# EAGLE design LED_Driver_Separate (EAGLE 9.6.2)
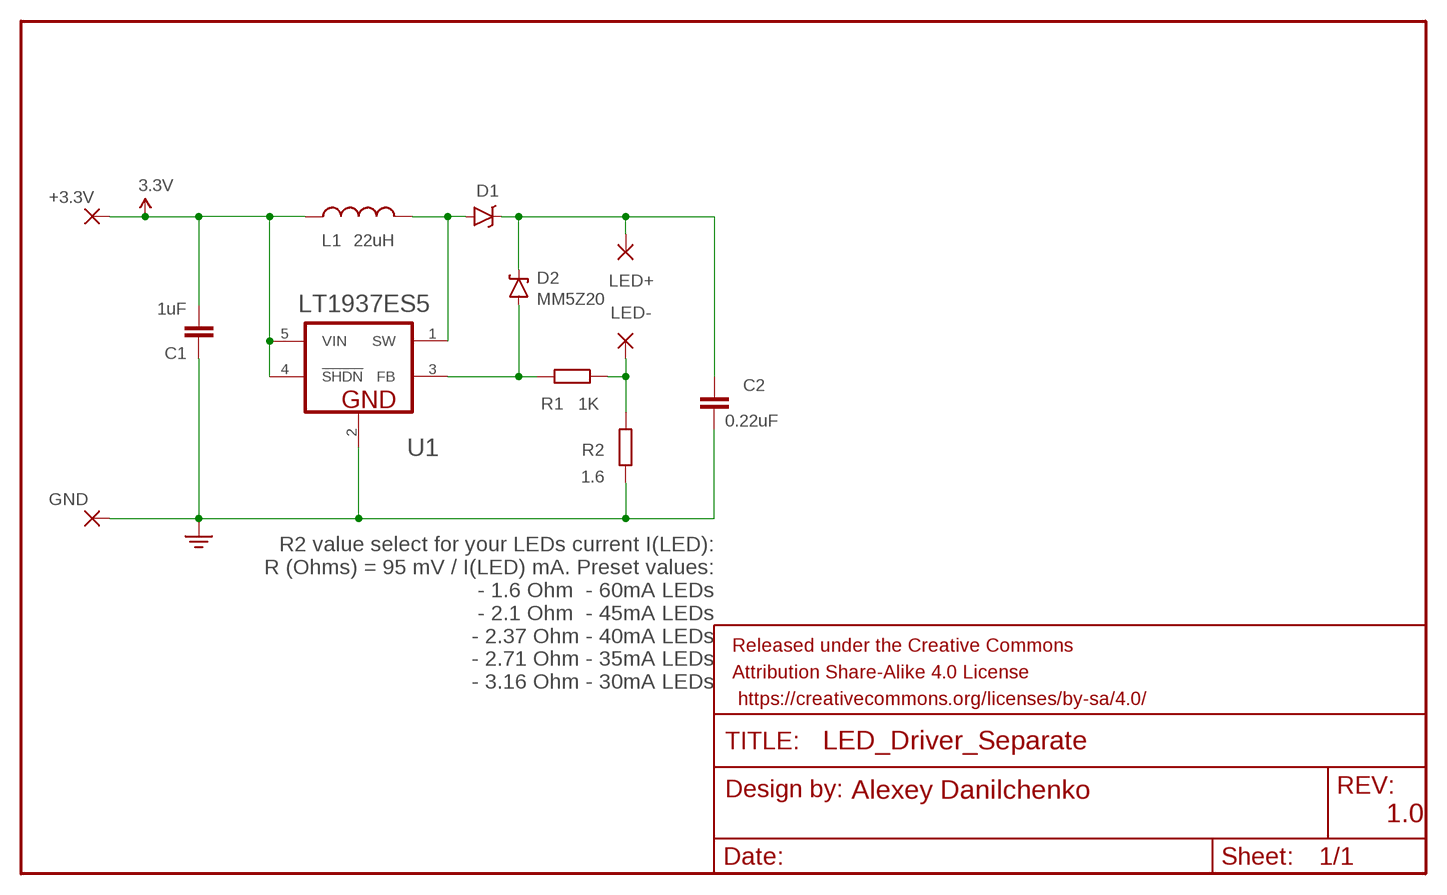
[diagram p0: schematic, sheet 1]

## Parts
+3.3V  SMD2X2  [SMD2,54-2,54]
C1  1uF  C-EUC0805  [C0805]
C2  0.22uF  CAP0603-CAP  [0603-CAP]
D1  RB751  DIODE-SCHOTTKY-RB751  [SOD-523]
D2  MM5Z20  DIODE-ZENERSOD-523Z  [SOD-523]
FRAME1  FRAME-LEDGER  [CREATIVE_COMMONS]
GND  SMD2X2  [SMD2,54-2,54]
L1  22uH  INDUCTOR1210  [1210]
LED+  SMD2X2  [SMD2,54-2,54]
LED-  SMD2X2  [SMD2,54-2,54]
R1  1K  R-EU_R0805  [R0805]
R2  1.6  R-EU_M1206  [M1206]
U1  LT1937ES5  LINEAR_TECHNOLOGY_LT1937ES5#TRMPBFLINEAR_TECHNOLOGY_LT1937ES5#TRMPBF_0_1  [LINEAR_TECHNOLOGY_LT1937ES5#TRMPBF_1]

## Nets
3.3V: +3.3V.1(P) C1.1 L1.1 U1.4(!SHDN!) U1.5(VIN)
GND: C1.2 C2.2 GND.1(P) R2.1 U1.2(GND)
N$1: D1.A L1.2 U1.1(SW)
N$2: D2.A R1.2 U1.3(FB)
N$6: LED-.1(P) R1.1 R2.2
N$7: C2.1 D1.C D2.C LED+.1(P)

## Notes on the sheet
- MM5Z20
- R2 value select for your LEDs current I(LED):
  R (Ohms) = 95 mV / I(LED) mA. Preset values:
   - 1.6 Ohm  - 60mA LEDs
   - 2.1 Ohm  - 45mA LEDs
   - 2.37 Ohm - 40mA LEDs
   - 2.71 Ohm - 35mA LEDs
   - 3.16 Ohm - 30mA LEDs

## Library data of the parts
+3.3V GND LED+ LED- = wirepad:SMD2X2: SMD PAD
C1 = rcl:C-EU: CAPACITOR, European symbol
C2 = SparkFun-Passives:CAP: Capacitor Standard 0603 ceramic capacitor, and 0.1" leaded capacitor.
D1 = SparkFun-DiscreteSemi:DIODE-SCHOTTKY: Schottky diodes in SFE's production catalog BAT20J 1A 23V 0.62Vf RB751 120mA 40V 0.37Vf PMEG4005EJ 0.5A 40V 0.42Vf MBRA140 1A 40V 0.5Vf B340A 3A 40V SMA; PROD_ID: DIO-11018
D2 = SparkFun-DiscreteSemi:DIODE-ZENER: Zener Diode Production Part - 8199 3.4V Zener Voltage
FRAME1 = SparkFun-Aesthetics:FRAME-LEDGER: Schematic Frame Standard 11x14 US Ledger frame; AUTHOR: Alexey Danilchenko; VER: 1.0
L1 = SparkFun-Passives:INDUCTOR: Inductors Basic Inductor/Choke - 0603 and 1206. Footprints are not proven and vary greatly between part numbers. INDUCTOR POWER 3.3UH 4.0A SMD 0.197" L x 0.197" W x 0.177" H (5.00mm x 5.00mm x 4.50mm)
R1 = Spectron2:R-EU_: RESISTOR, European symbol
R2 = rcl:R-EU_: RESISTOR, European symbol; SPICEPREFIX: R
U1 = LT1937ES5:LINEAR_TECHNOLOGY_LT1937ES5#TRMPBF: LT-LT1937-S5-5; CIIVA_IDS: 1159927; CODE__JEDEC: MO-193; COMPONENT_LINK_1_DESCRIPTION: Manufacturer URL; COMPONENT_LINK_1_URL: http://www.linear.com/; COMPONENT_LINK_3_DESCRIPTION: Package Specification; COMPONENT_LINK_3_URL: http://cds.linear.com/docs/en/packaging/SOT_5_05-08-1635.pdf; DATASHEET: http://cds.linear.com/docs/en/datasheet/1937f.pdf; FOOTPRINT_VARIANT_NAME_0: Level C; FOOTPRINT_VARIANT_NAME_1: Level B; FOOTPRINT_VARIANT_NAME_2: Level A; IMPORTED: yes; IMPORTED_FROM: vault; IMPORT_TS: 1521849081; MF: Linear Technology; MOUNTING_TECHNOLOGY: Surface Mount; MPN: LT1937ES5#TRMPBF; PACKAGE: S5-5; PACKAGE_DESCRIPTION: 5-Pin Plastic TSOT-23, Body 1.63 x 2.90 mm, Pitch 0.95 mm; PACKAGE_VERSION: Jun-10; PACKING: Mini Tape and Reel; PREFIX: U; RELEASE_DATE: 1377826763; ROHS: Yes; TOPOLOGY: Boost, LED Driver; VAULT_GUID: 5DE084F1-2912-492B-B132-4CB47614E220; VAULT_REVISION: A53C5704-23FA-4F88-86CB-19E9C1DD8ED3; VIN_MINV: 2.5

## Board
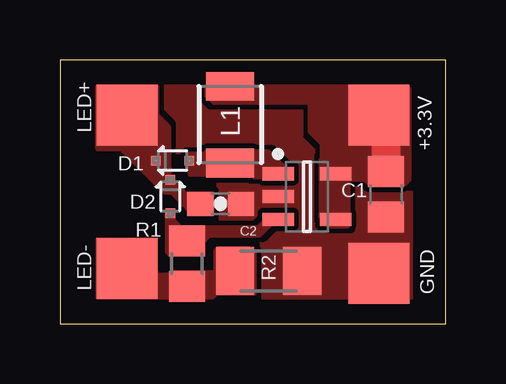
[diagram p1: board, top side]

Size 16.1 x 11 mm. Coordinates in mm from the lower left corner, seen from the top.
Outline: 0,0 16.1,0 16.1,11 0,11 0,0
Copper layers (1*16): Top 0.035mm / dielectric 1.5mm / Bottom 0.035mm
Design rules "default": minimum track width 10mil, minimum drill 24mil, track to track 8mil, track to pad 8mil, pad to pad 8mil, via to via 8mil, smd to smd 8mil, copper to edge 40mil, drill to drill 8mil, minimum pad ring 10mil, minimum via ring 8mil, stop-mask expansion 4mil, vias tented up to drill 0mil, thermal gap 10mil

### Footprints (pad centres in the part's own frame; a part is rotated, then mirrored left to right if it is on the bottom)
SMD2,54-2,54 = smd 2.54 x 2.54: 1 0,0
C0805 = smd 1.3 x 1.5: 1 -0.95,0; 2 0.95,0
0603-CAP = smd 1.1 x 1: 1 -0.85,0; 2 0.85,0
SOD-523 = smd 0.4 x 0.4: A -0.7,0; C 0.7,0
1210 = smd 1.2 x 2: 1 -1.6,0; 2 1.6,0
R0805 = smd 1.3 x 1.5: 1 -0.95,0; 2 0.95,0
M1206 = smd 1.6 x 2: 1 -1.4,0; 2 1.4,0
LINEAR_TECHNOLOGY_LT1937ES5#TRMPBF_1 = smd 1.3 x 0.55: 1 -1.2,0.95; 2 -1.2,0; 3 -1.2,-0.95; 4 1.2,-0.95; 5 1.2,0.95

### Placement (x,y rotation side)
+3.3V  13.3,8.7 90 top
C1  13.6,5.4 270 top
C2  6.7,5 0 top
D1  4.7,6.8 180 top
D2  4.6,5.3 90 top
FRAME1  0.5,0 0 top
GND  13.3,2.1 90 top
L1  7.1,8.3 270 top
LED+  2.8,8.7 180 top
LED-  2.8,2.3 180 top
R1  5.3,2.5 90 top
R2  8.7,2.2 180 top
U1  10.3,5.3 0 top

### Tracks (layer width: path | path; a pad name or v marks a point on that pad's centre or on a via)
3.3V
  Top 1.2: +3.3V.1 13.6,8.4 C1.1
  pour Top (no thermals): 6.1,10.4 11.4,10.4 11.9,9.9 14.5,9.9 14.6,9.8 14.6,6 14.4,5.8 12.9,5.8 12.7,6 11,6 10.9,6.1 10.9,7.5 10.4,8 10.4,9.2 6.4,9.2 6.2,9.4 6.1,9.5
  pour Top (no thermals): 12,4.1 12,6.5 12.4,6.9 11,6.9 10.9,6.8 10.9,4.5 11.2,4.2 11.3,4.1
GND
  pour Top (rank 6, no thermals): 0.5,11 14.6,11 14.6,0 0.5,0
N$1
  pour Top (no thermals): 5.4,7.1 6,7.1 6.1,7.2 8.7,7.2 9.5,6.4 9.7,6.4 9.7,6.1 8.1,6.1 8,6.2 5.4,6.2
N$2
  pour Top (no thermals): 4.5,3 4.5,4.7 4.7,4.7 4.7,4.3 5,4 8.3,4 8.8,4.5 9.6,4.5 9.6,4.2 8.8,4.2 8.3,3.7 6.2,3.7 5.9,3.4 5.9,2.9 4.6,2.9
N$6
  Top 1.016: LED-.1 3.55,1.55
  Top 1.2: LED-.1 3.48,1.62
  pour Top (no thermals): 1.6,1.1 5.9,1.1 6,1 6.2,1 6.5,1.3 8.1,1.3 8.1,2.9 8,3 7.9,3.1 6.6,3.1 6.5,3 6.5,2.1 4.7,2.1 4.6,2 4.1,2 3.9,2.2 3.9,3.3 4,3.4 1.7,3.4 1.6,3.5
N$7
  pour Top (no thermals): 1.6,9.9 4,9.9 4,8.7 4.5,8.2 4.5,6.1 5.2,5.4 6.3,5.4 6.3,4.6 5.6,4.6 4.7,5.5 4.4,5.5 2.6,7.3 1.6,7.3

### Text on the board
tNames: D2